# EAGLE schematic BlueProgrammer (EAGLE 7.1.0)
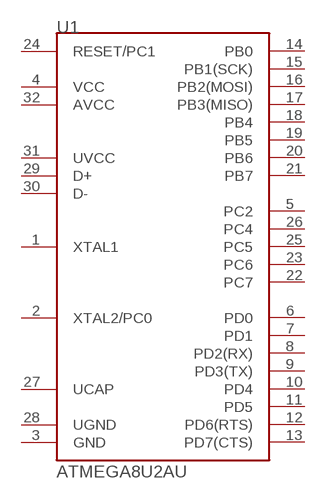
[diagram p0: schematic, sheet 1]

## Parts
U1  ATMEGA8U2AU  [TQFP32-08]
Unconnected: U1.1(XTAL1) U1.2(XTAL2/PC0) U1.3(GND) U1.4(VCC) U1.5(PC2) U1.6(PD0) U1.7(PD1) U1.8(PD2(RX)) U1.9(PD3(TX)) U1.10(PD4) U1.11(PD5) U1.12(PD6(RTS)) U1.13(PD7(CTS)) U1.14(PB0) U1.15(PB1(SCK)) U1.16(PB2(MOSI)) U1.17(PB3(MISO)) U1.18(PB4) U1.19(PB5) U1.20(PB6) U1.21(PB7) U1.22(PC7) U1.23(PC6) U1.24(RESET/PC1) U1.25(PC5) U1.26(PC4) U1.27(UCAP) U1.28(UGND) U1.29(D+) U1.30(D-) U1.31(UVCC) U1.32(AVCC)

## Library data of the parts
U1 = SparkFun-DigitalIC:ATMEGA8U2: Atmel 32-pin 8-bit Microcontroller with 8/16/32K Bystes of ISP Flash and USB Controller. ATmega8U2, ATmega16U2, and ATmega32U2